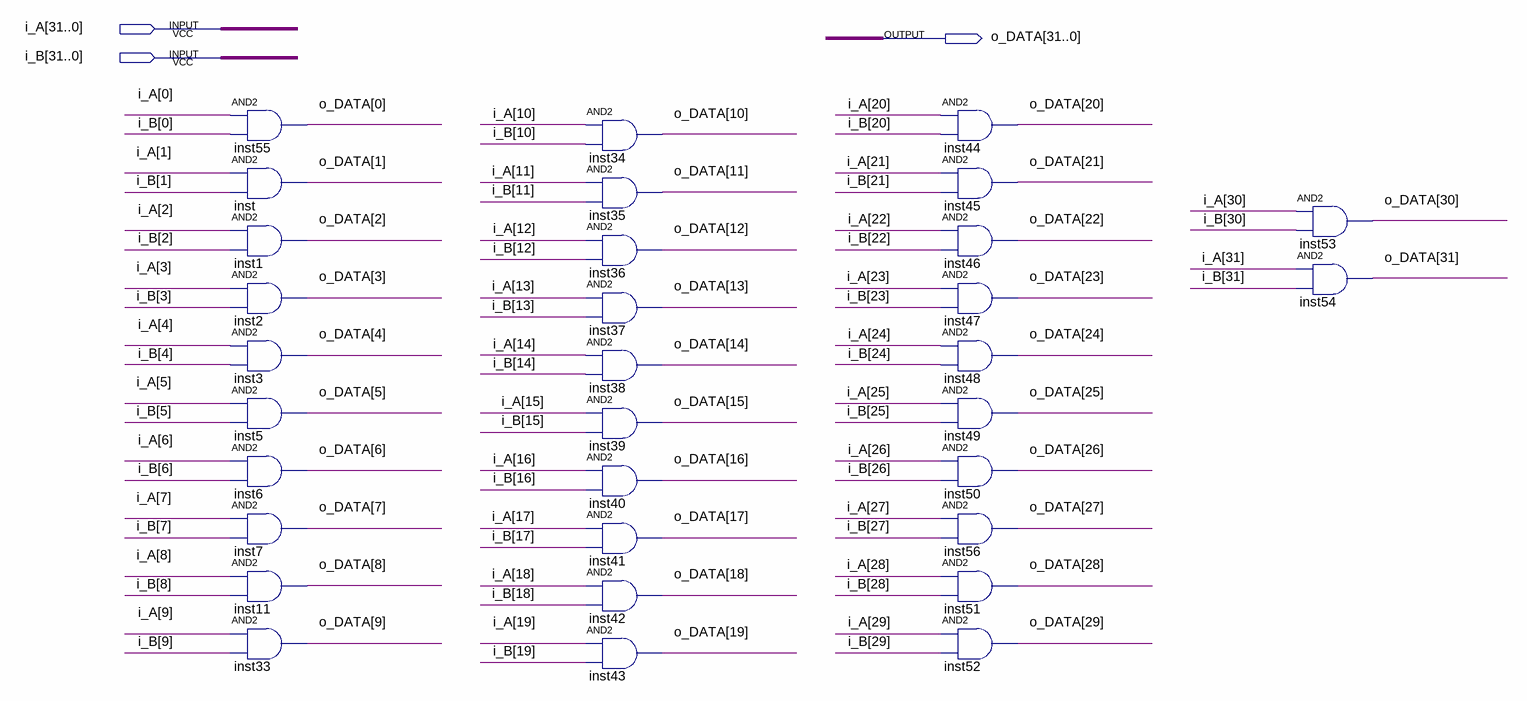
[diagram p0: schematic sheet]
// Quartus schematic and32.bdf as structural Verilog: 32 symbols, 3 pins
module and32 (
  input  [31:0] i_A,
  input  [31:0] i_B,
  output [31:0] o_DATA
);

  and inst55 (o_DATA[0], i_A[0], i_B[0]);
  and inst (o_DATA[1], i_A[1], i_B[1]);
  and inst1 (o_DATA[2], i_A[2], i_B[2]);
  and inst2 (o_DATA[3], i_A[3], i_B[3]);
  and inst3 (o_DATA[4], i_A[4], i_B[4]);
  and inst5 (o_DATA[5], i_A[5], i_B[5]);
  and inst6 (o_DATA[6], i_A[6], i_B[6]);
  and inst7 (o_DATA[7], i_A[7], i_B[7]);
  and inst11 (o_DATA[8], i_A[8], i_B[8]);
  and inst33 (o_DATA[9], i_A[9], i_B[9]);
  and inst34 (o_DATA[10], i_A[10], i_B[10]);
  and inst35 (o_DATA[11], i_A[11], i_B[11]);
  and inst36 (o_DATA[12], i_A[12], i_B[12]);
  and inst37 (o_DATA[13], i_A[13], i_B[13]);
  and inst38 (o_DATA[14], i_A[14], i_B[14]);
  and inst39 (o_DATA[15], i_A[15], i_B[15]);
  and inst40 (o_DATA[16], i_A[16], i_B[16]);
  and inst41 (o_DATA[17], i_A[17], i_B[17]);
  and inst42 (o_DATA[18], i_A[18], i_B[18]);
  and inst43 (o_DATA[19], i_A[19], i_B[19]);
  and inst44 (o_DATA[20], i_A[20], i_B[20]);
  and inst45 (o_DATA[21], i_A[21], i_B[21]);
  and inst46 (o_DATA[22], i_A[22], i_B[22]);
  and inst47 (o_DATA[23], i_A[23], i_B[23]);
  and inst48 (o_DATA[24], i_A[24], i_B[24]);
  and inst49 (o_DATA[25], i_A[25], i_B[25]);
  and inst50 (o_DATA[26], i_A[26], i_B[26]);
  and inst56 (o_DATA[27], i_A[27], i_B[27]);
  and inst51 (o_DATA[28], i_A[28], i_B[28]);
  and inst52 (o_DATA[29], i_A[29], i_B[29]);
  and inst53 (o_DATA[30], i_A[30], i_B[30]);
  and inst54 (o_DATA[31], i_A[31], i_B[31]);
endmodule
